# EAGLE design pcb01_power (EAGLE 6.4)
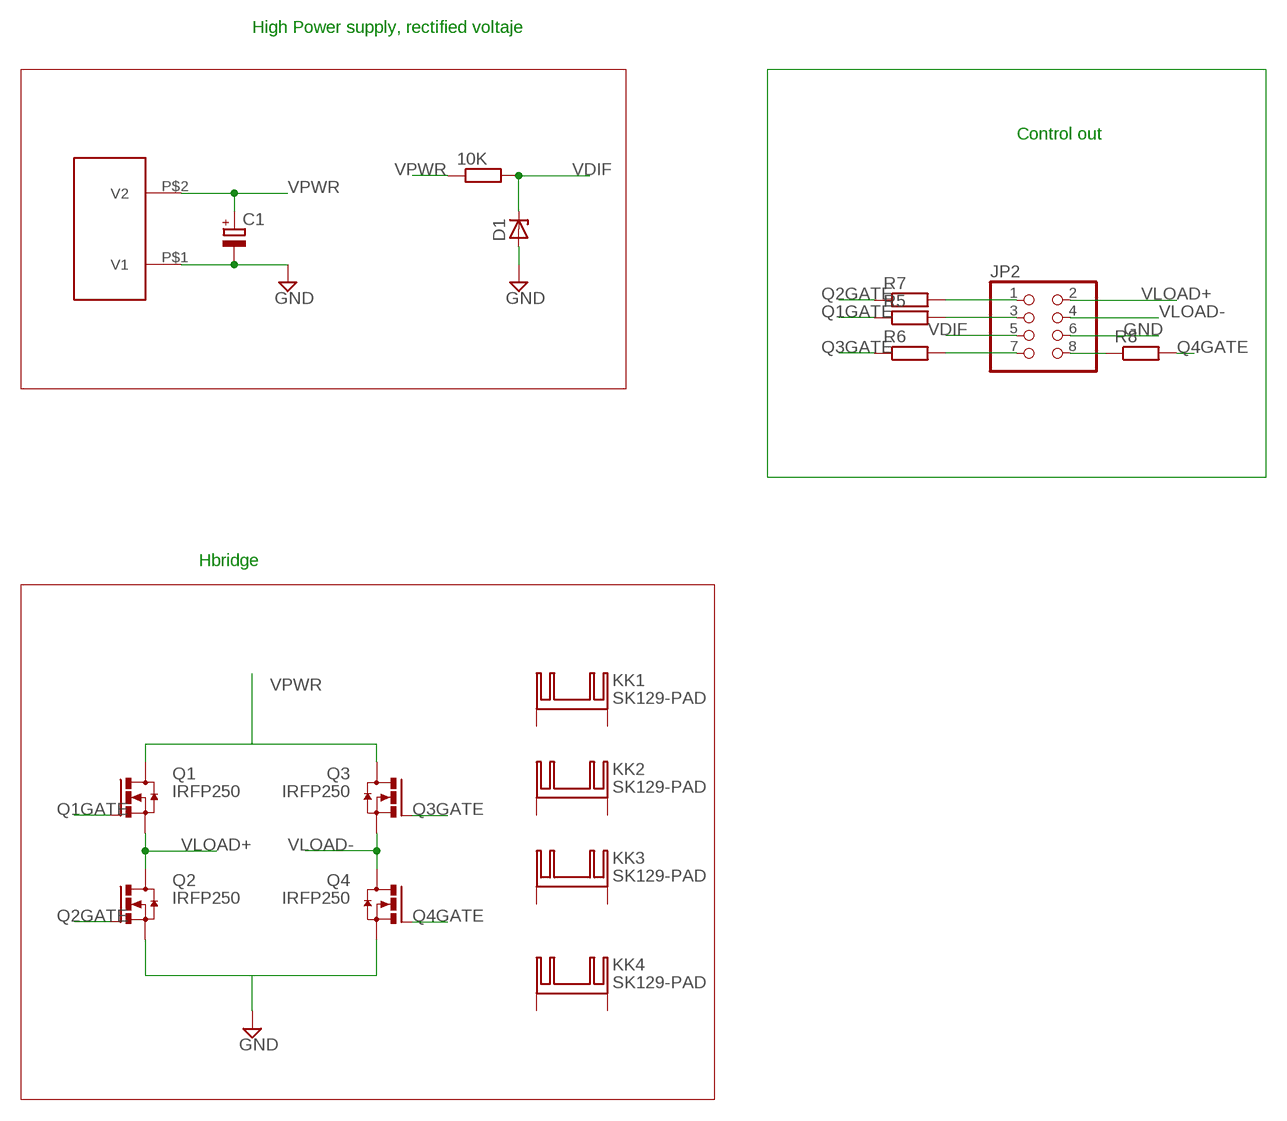
[diagram p0: schematic, sheet 1]

## Parts
10K  R-EU_V234/12  [V234/12]
C1  CPOL-EUE7.5-16  [E7,5-16]
D1  ZENER-DIODEDO35Z10  [DO35Z10]
JP2  PINHD-2X4  [2X04]
KK1  SK129-PAD  [SK129]
KK2  SK129-PAD  [SK129]
KK3  SK129-PAD  [SK129]
KK4  SK129-PAD  [SK129]
Q1  IRFP250  [TO-247AD-V]
Q2  IRFP250  [TO-247AD-V]
Q3  IRFP250  [TO-247AD-V]
Q4  IRFP250  [TO-247AD-V]
R5  R-EU_0207/12  [0207/12]
R6  R-EU_0207/12  [0207/12]
R7  R-EU_0207/12  [0207/12]
R8  R-EU_0207/12  [0207/12]
U$1  BIGPLUG  [BIGPLUG]

## Nets
GND: C1.- D1.A JP2.6 Q2.S Q4.S U$1.P$1(V1)
N$7: JP2.3 R5.2
N$8: JP2.7 R6.2
N$9: JP2.1 R7.2
N$10: JP2.8 R8.1
Q1GATE: Q1.G R5.1
Q2GATE: Q2.G R7.1
Q3GATE: Q3.G R6.1
Q4GATE: Q4.G R8.2
VDIF: 10K.2 D1.C JP2.5
VLOAD+: JP2.2 Q1.S Q2.D
VLOAD-: JP2.4 Q3.S Q4.D
VPWR: 10K.1 C1.+ Q1.D Q3.D U$1.P$2(V2)
Unconnected: KK1.A2,5(K) KK1.B2,5(K) KK2.A2,5(K) KK2.B2,5(K) KK3.A2,5(K) KK3.B2,5(K) KK4.A2,5(K) KK4.B2,5(K)

## Notes on the sheet
- High Power supply, rectified voltaje
- Control out
- Hbridge

## Library data of the parts
10K R5-R8 = rcl:R-EU_: RESISTOR, European symbol
C1 = resistor:CPOL-EU: POLARIZED CAPACITOR, European symbol
D1 = diode:ZENER-DIODE: Z-Diode
JP2 = adafruit:PINHD-2X4: PIN HEADER
KK1-KK4 = heatsink:SK129-PAD: HEATSINK manufacturer Fischer/distributor Buerklin
Q1-Q4 = transistor-power:IRFP25*: 33A/27A, 200V/150V, 0.085/0.012 Ohm, N-Channel Power MOSFET Source: Fairchild Semiconductor Corporation
U$1 = fablibr:BIGPLUG

## Board
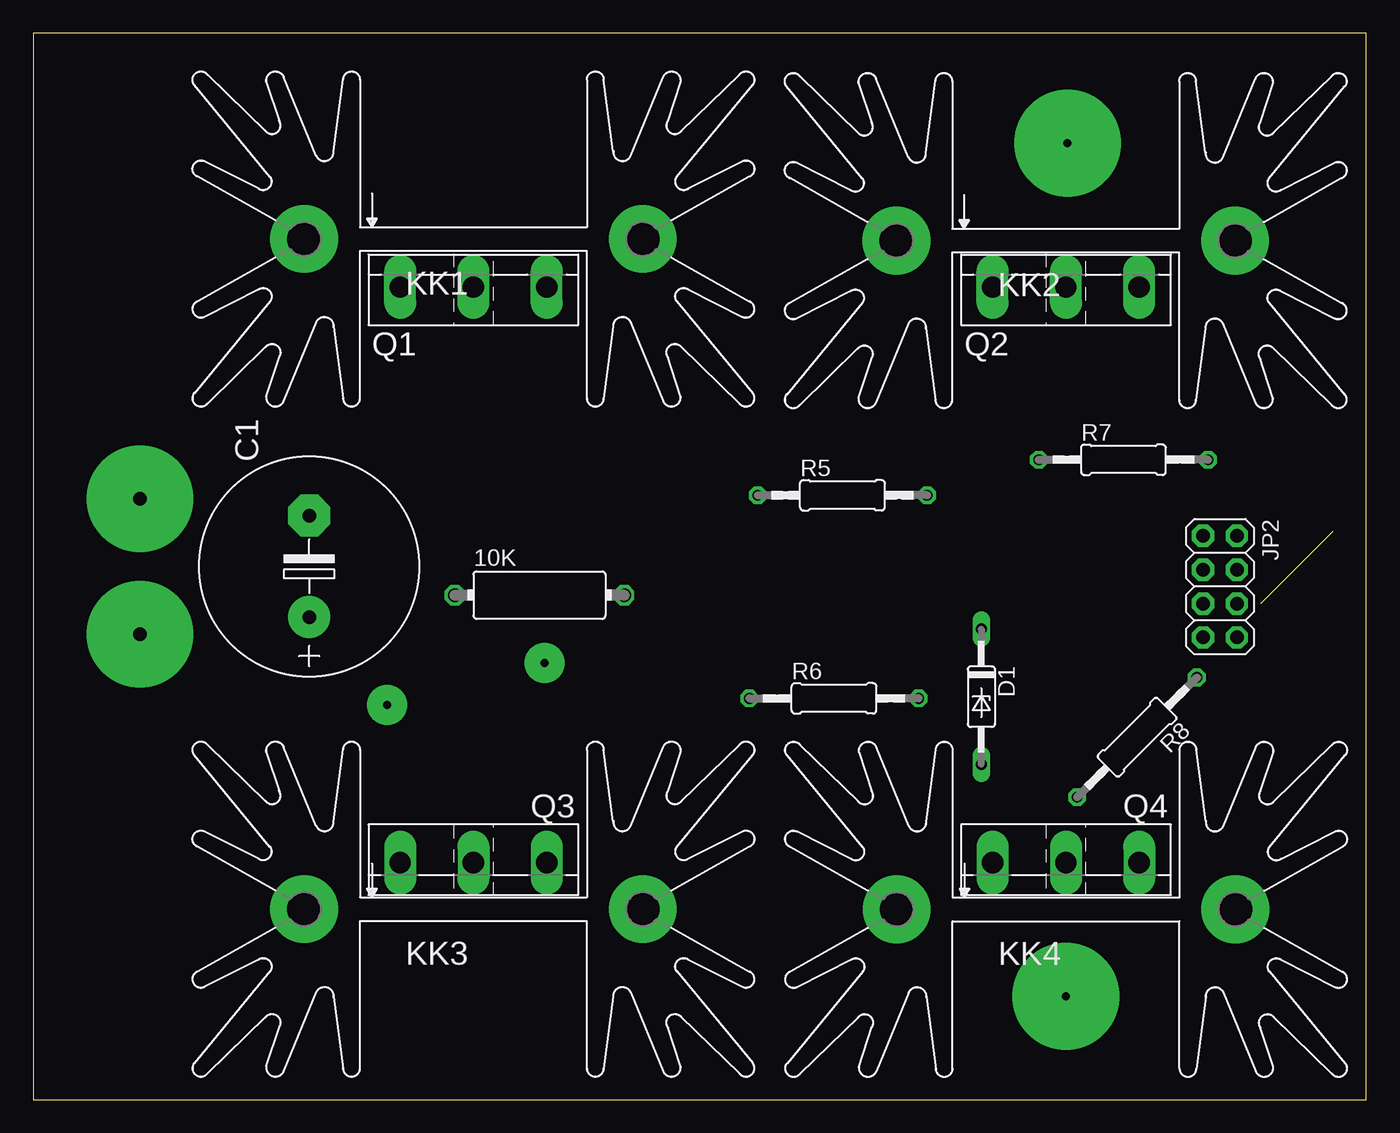
[diagram p1: board, top side]
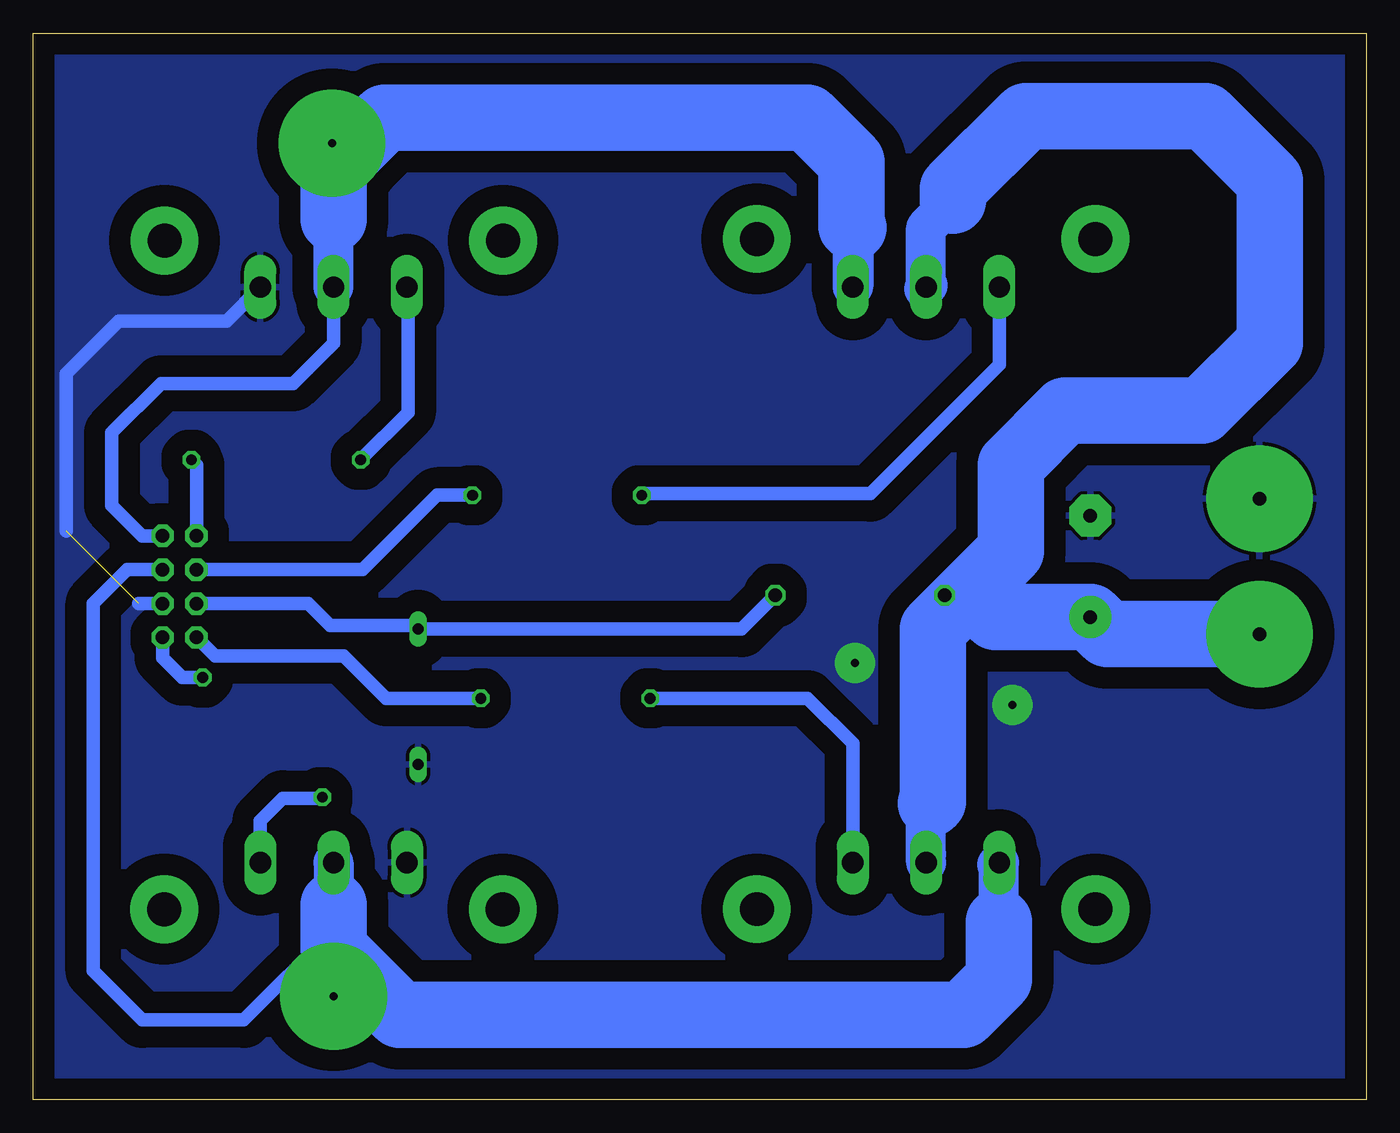
[diagram p2: board, bottom side, seen from below]

Size 100 x 80 mm. Coordinates in mm from the lower left corner, seen from the top.
Outline: 0,0 100,0 100,80 0,80 0,0
Copper layers (1*16): Top 0.035mm / dielectric 1.5mm / Bottom 0.035mm
Design rules "default": minimum track width 10mil, minimum drill 24mil, track to track 8mil, track to pad 8mil, pad to pad 8mil, via to via 8mil, smd to smd 8mil, copper to edge 40mil, drill to drill 8mil, minimum pad ring 10mil, minimum via ring 8mil, stop-mask expansion 4mil, vias tented up to drill 0mil, thermal gap 10mil

### Footprints (pad centres in the part's own frame; a part is rotated, then mirrored left to right if it is on the bottom)
V234/12 = drill 1.016 octagon: 1 -6.35,0; 2 6.35,0
E7,5-16 = drill 1.016 pad 3.15: + -3.81,0 | drill 1.016 pad 3.15 octagon: - 3.81,0
DO35Z10 = drill 0.813 long: A 5.08,0; C -5.08,0
2X04 = drill 1.016 pad 1.676 octagon: 1 -3.81,-1.27; 2 -3.81,1.27; 3 -1.27,-1.27; 4 -1.27,1.27; 5 1.27,-1.27; 6 1.27,1.27; 7 3.81,-1.27; 8 3.81,1.27
SK129 = drill 2.54 pad 5.08: A2,5 -12.7,-0.889; B2,5 12.7,-0.889
TO-247AD-V = drill 1.6 long: D 0,-2.54; G -5.5,-2.54; S 5.5,-2.54
0207/12 = drill 0.813 octagon: 1 -6.35,0; 2 6.35,0
BIGPLUG = drill 1 pad 8: P$1 0,0; P$2 0,10.16

### Placement (x,y rotation side)
10K  37.97,37.85 0 top
C1  20.7,40.01 90 top
D1  71.12,30.23 270 top
JP2  89.03,38.48 270 top
KK1  33.02,65.46 0 top
KK2  77.46,65.34 0 top
KK3  33.02,15.18 0 top
KK4  77.48,15.16 0 top
Q1  33.02,63.5 0 top
Q2  77.47,63.5 0 top
Q3  33.02,15.24 180 top
Q4  77.47,15.24 180 top
R5  60.71,45.34 0 top
R6  60.07,30.1 0 top
R7  81.79,48.01 0 top
R8  82.8,27.18 225 top
U$1  8,45.09 180 top

### Tracks (layer width: path | path; a pad name or v marks a point on that pad's centre or on a via)
GND  (via drill 0.6 pad 3)  (1 unrouted)
  Bottom 1: JP2.6 92.08,37.21 | 97.54,42.67 97.54,54.48 93.6,58.42 85.51,58.42 Q2.S
  other vias: 26.54,29.59 38.35,32.77
  pour Bottom (isolate 1.6): -2.79,82.93 101.6,82.55 101.6,-2.54 -2.54,-2.54
N$1  (via drill 0.6 pad 8)
  other vias: 77.6,71.75
N$2  (via drill 0.6 pad 8)
  other vias: 77.47,7.75
N$7
  Bottom 1: R5.2 69.72,45.34 75.31,39.75 JP2.3
N$8
  Bottom 1: R6.2 73.53,30.1 76.71,33.27 86.36,33.27 JP2.7
N$9
  Bottom 1: JP2.1 87.76,47.62 R7.2
N$10
  Bottom 1: R8.1 88.82,31.67 90.3,33.15 JP2.8
Q1GATE
  Bottom 1: Q1.G 27.52,55.16 37.21,45.47 54.23,45.47 R5.1
Q2GATE
  Bottom 1: Q2.G 71.88,60.87 71.88,51.56 R7.1
Q3GATE
  Bottom 1: Q3.G 38.52,26.71 41.91,30.1 R6.1
Q4GATE
  Bottom 1: Q4.G 82.97,20.92 81.28,22.61 78.4,22.61 R8.2
VDIF
  Bottom 1: JP2.5 79.38,37.21 77.72,35.56 71.37,35.56 D1.C 46.86,35.31 10K.2
VLOAD+
  Bottom 1: Q2.D 77.47,56.77 80.52,53.72 90.42,53.72 94.11,50.04 94.11,44.58 91.82,42.29 JP2.2
  Bottom 3: Q2.D 77.47,66.04 | 38.61,64.14 38.52,64.05 Q1.S 38.48,61 38.48,65.41
  Bottom 5: 77.47,66.04 77.47,69.85 73.66,73.66 41.91,73.66 38.61,70.36 38.61,65.53 38.48,65.41
VLOAD-
  Bottom 1: Q4.D 77.47,12.7 84.2,5.97 91.82,5.97 95.5,9.65 95.5,37.21 92.96,39.75 JP2.4
  Bottom 3: Q4.D 77.47,14.61 | 27.69,17.61 Q3.S 27.56,17.74 27.56,13.34
  Bottom 5: 77.47,14.61 77.47,11.3 72.52,6.35 30.23,6.35 27.56,9.02 27.56,13.34
VPWR
  Bottom 2: 32.64,22.23 32.64,18.8 33.02,18.41 | 10K.1 29.46,37.85 29.27,37.66
  Bottom 3: 33.15,60.83 Q1.D | Q3.D 33.02,18.41 33.02,20.7 | 32.89,61.09 Q1.D | Q1.D 33.02,65.41 30.99,67.44
  Bottom 5: U$1.P$2 19.43,34.92 C1.+ 27.81,36.2 29.27,37.66 29.72,38.1 | 29.72,38.1 32.51,35.31 32.51,22.35 32.64,22.23 | 29.72,38.1 26.67,41.15 26.67,47.62 22.61,51.69 12.32,51.69 7.24,56.77 7.24,68.96 12.06,73.79 25.53,73.79 30.99,68.33 30.99,67.44